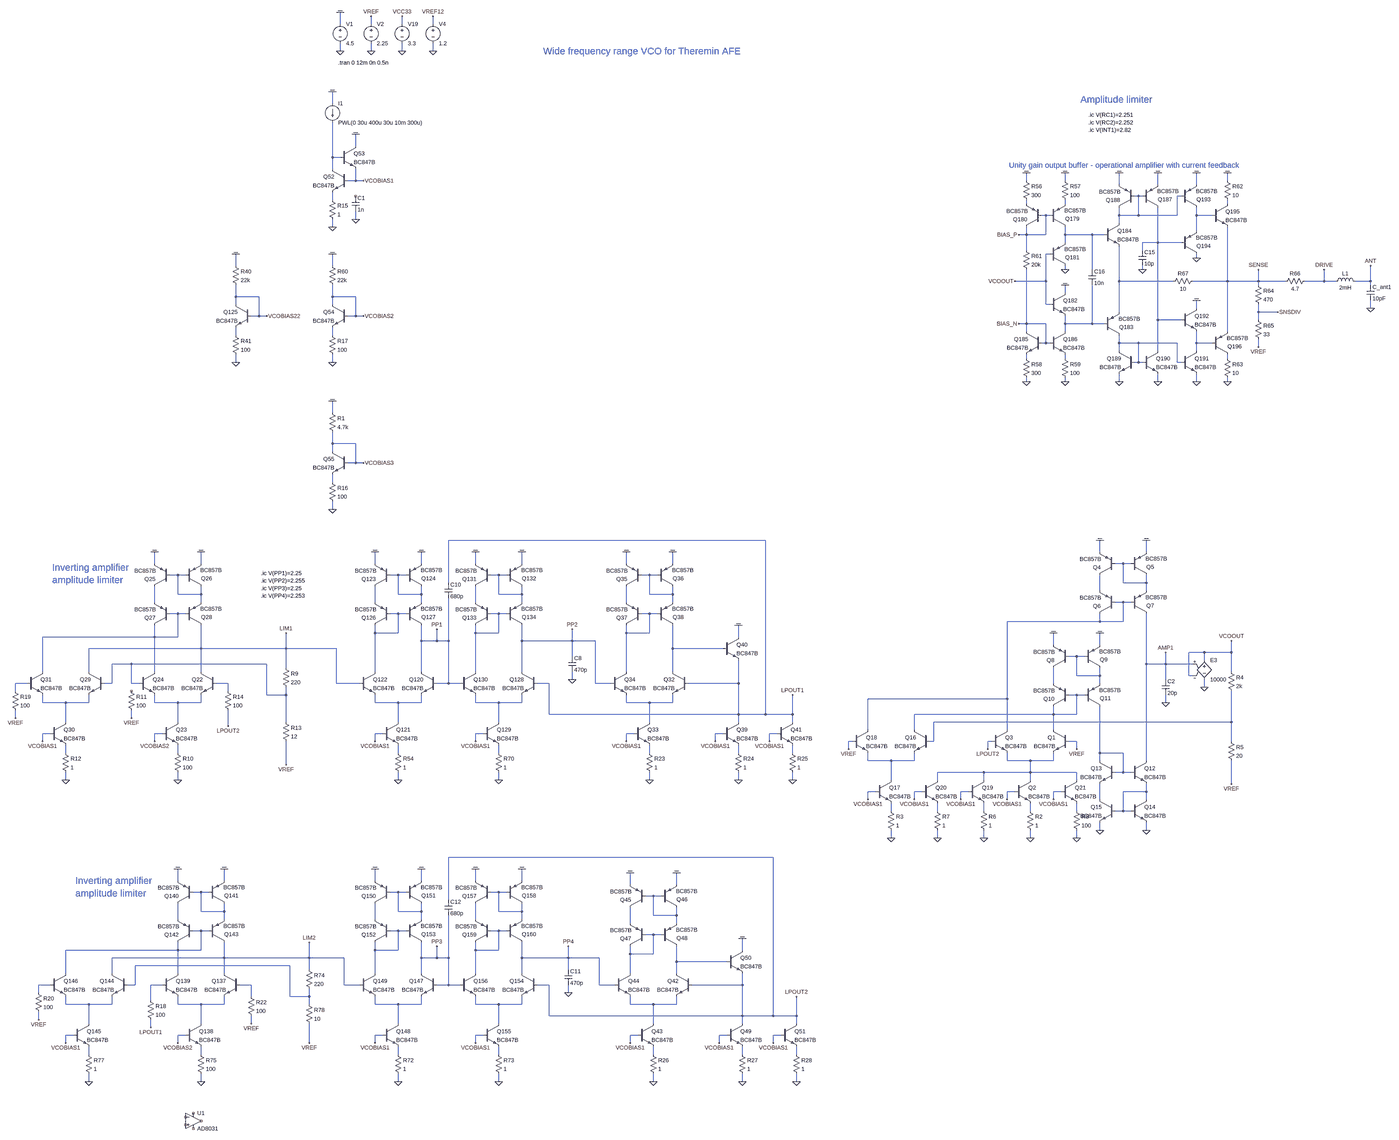
[diagram p0: schematic vco_sine_bjt_v03.asc, whole sheet]
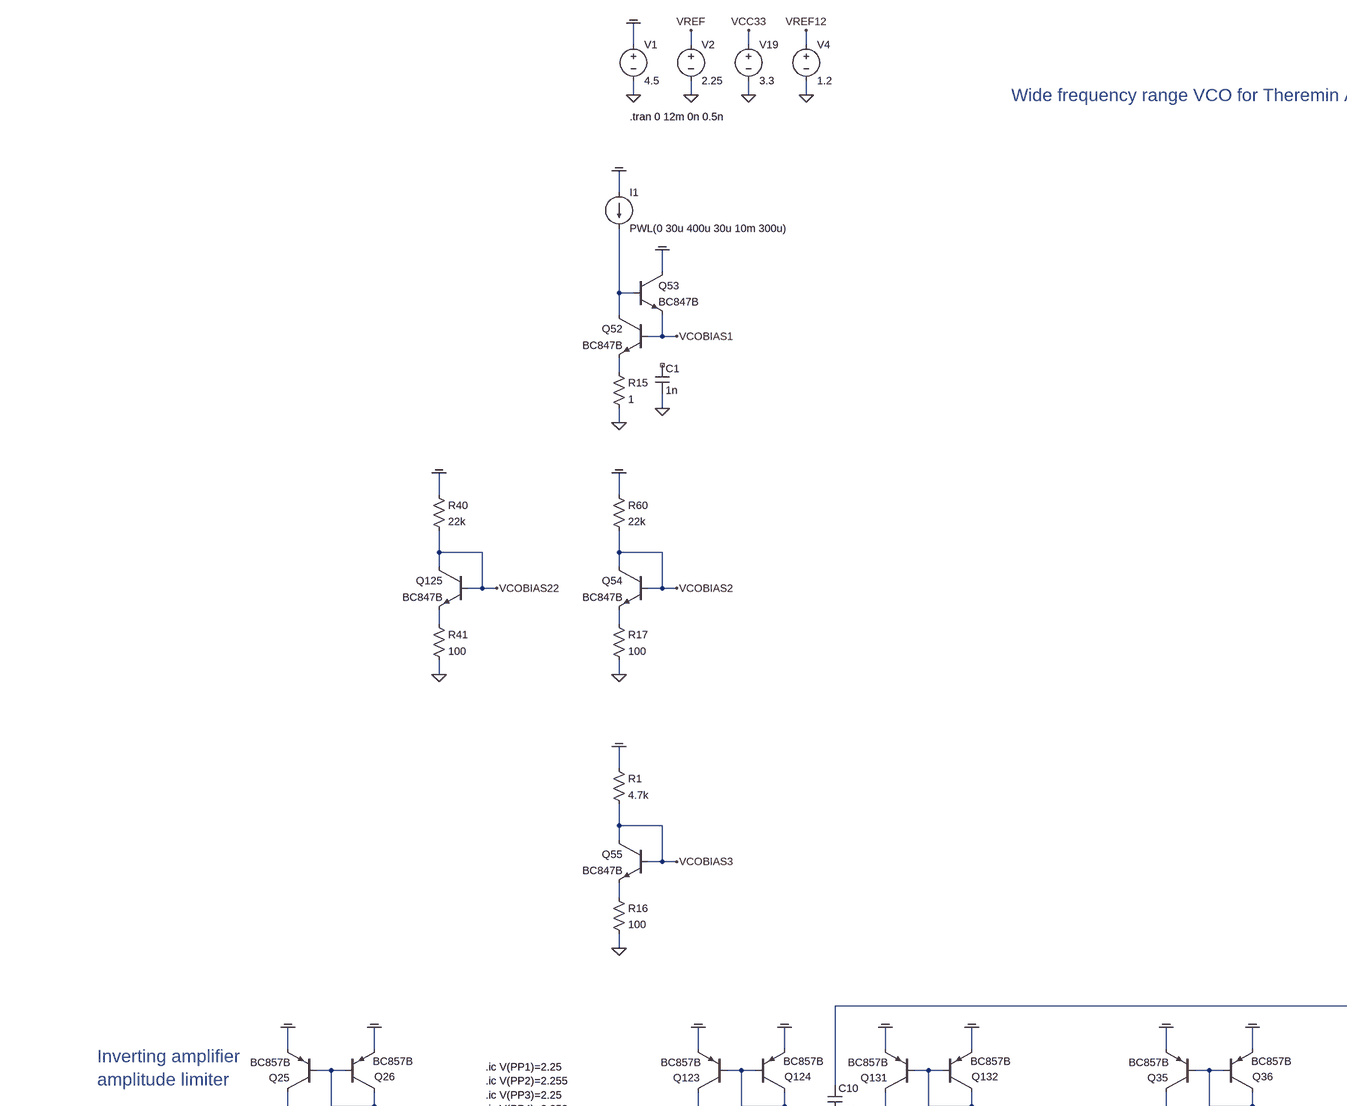
[diagram p1: schematic vco_sine_bjt_v03.asc, part, row 1 of 2, column 1 of 2]
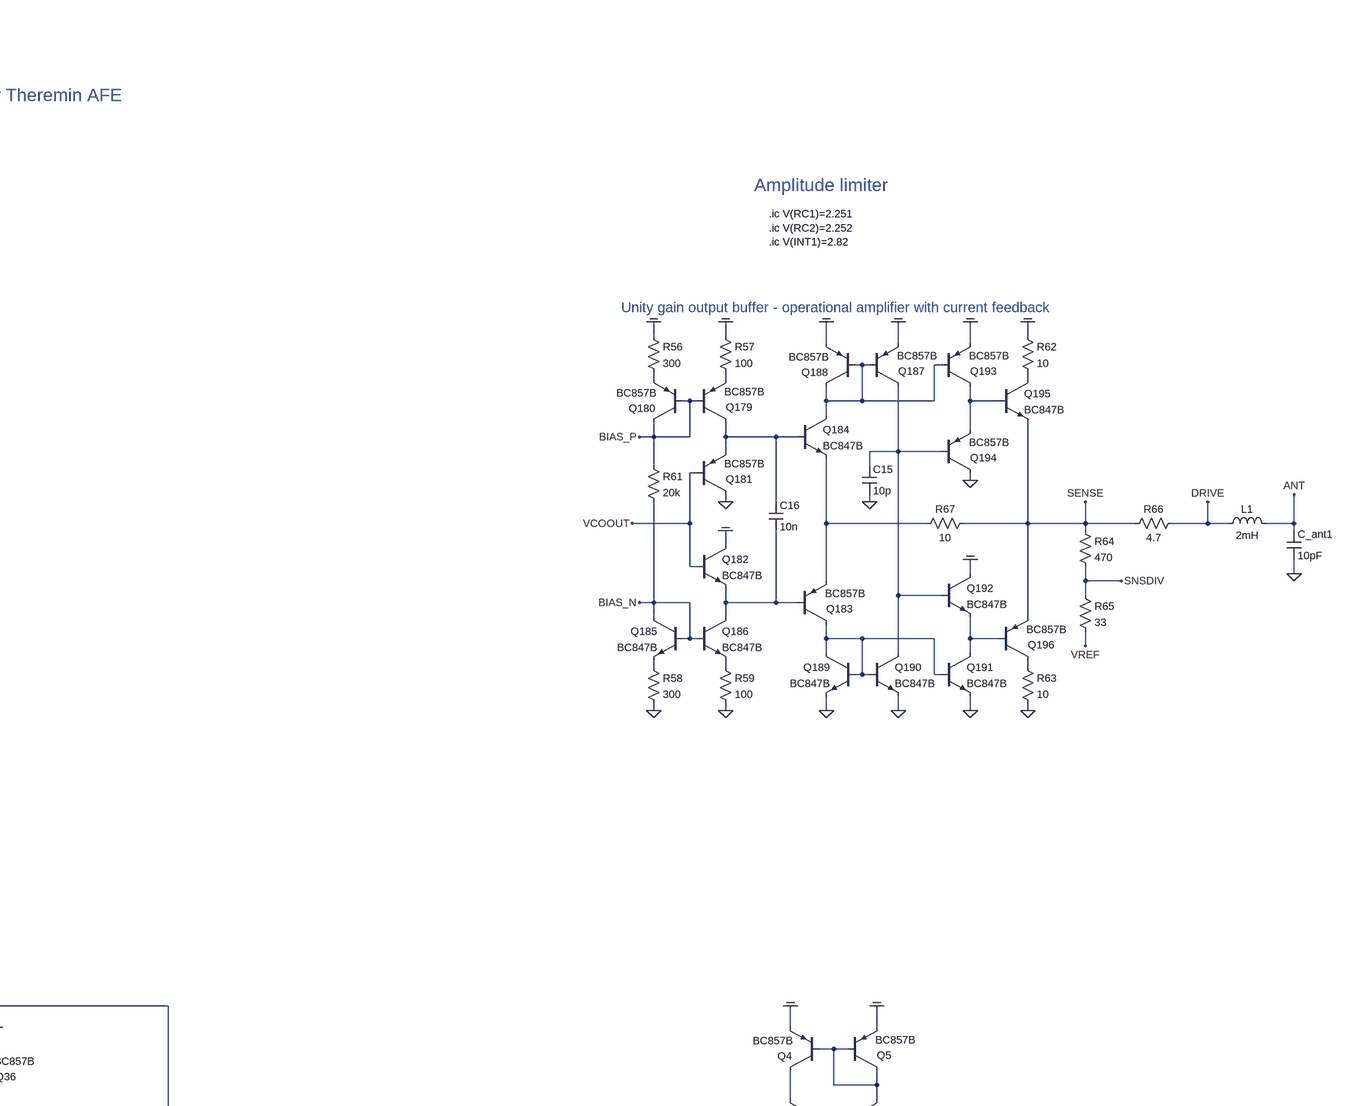
[diagram p2: schematic vco_sine_bjt_v03.asc, part, row 1 of 2, column 2 of 2]
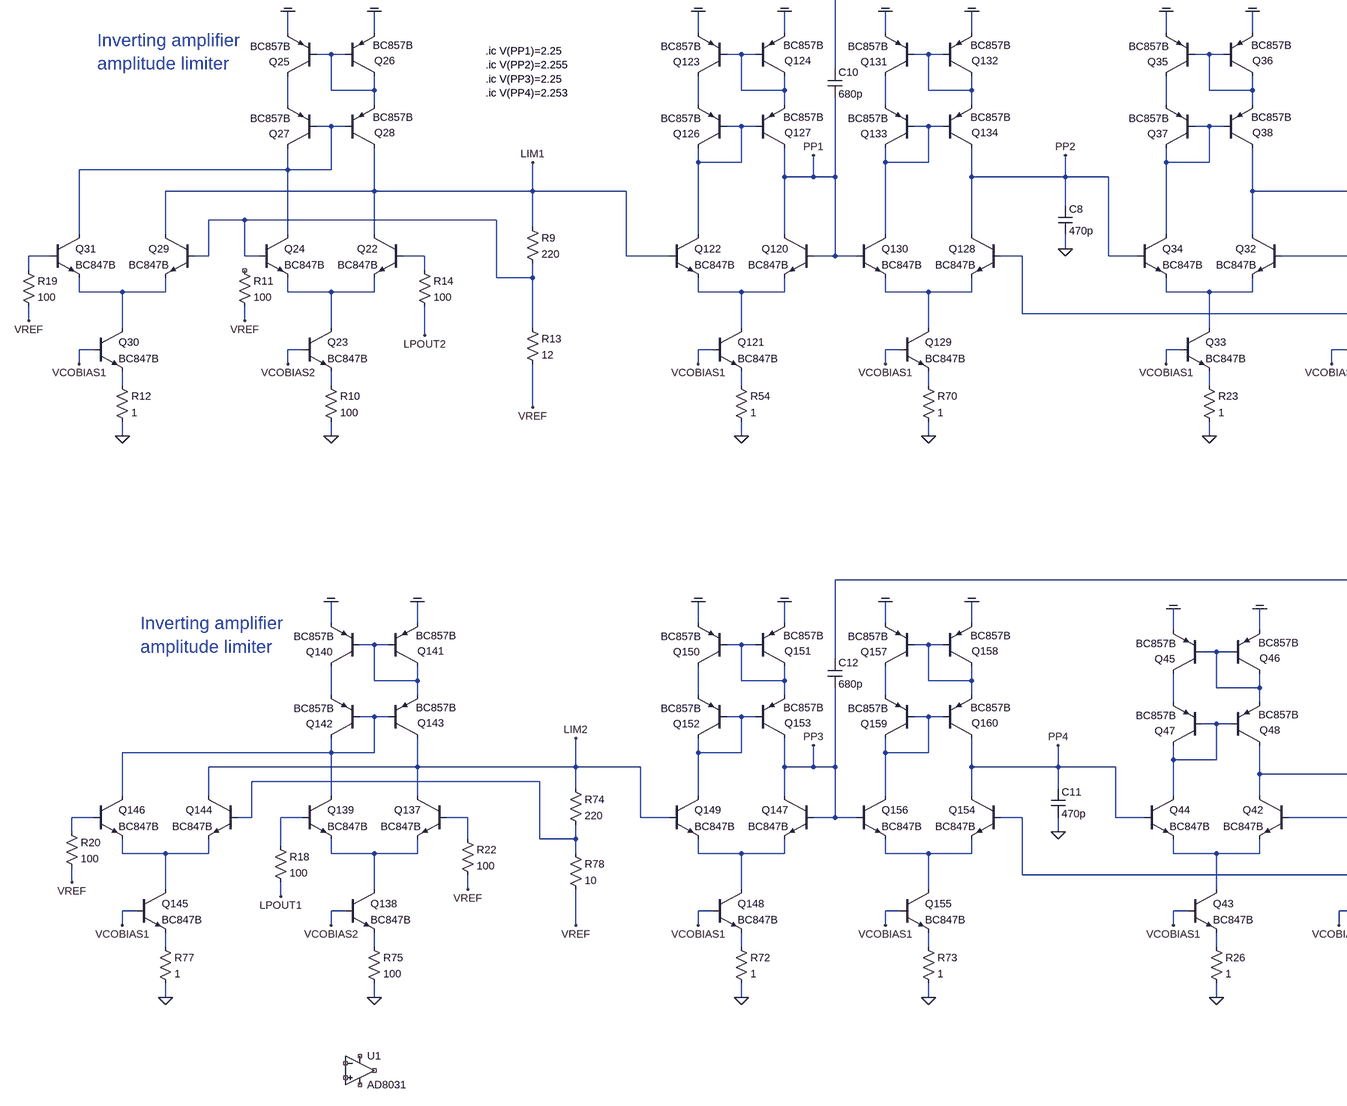
[diagram p3: schematic vco_sine_bjt_v03.asc, part, row 2 of 2, column 1 of 2]
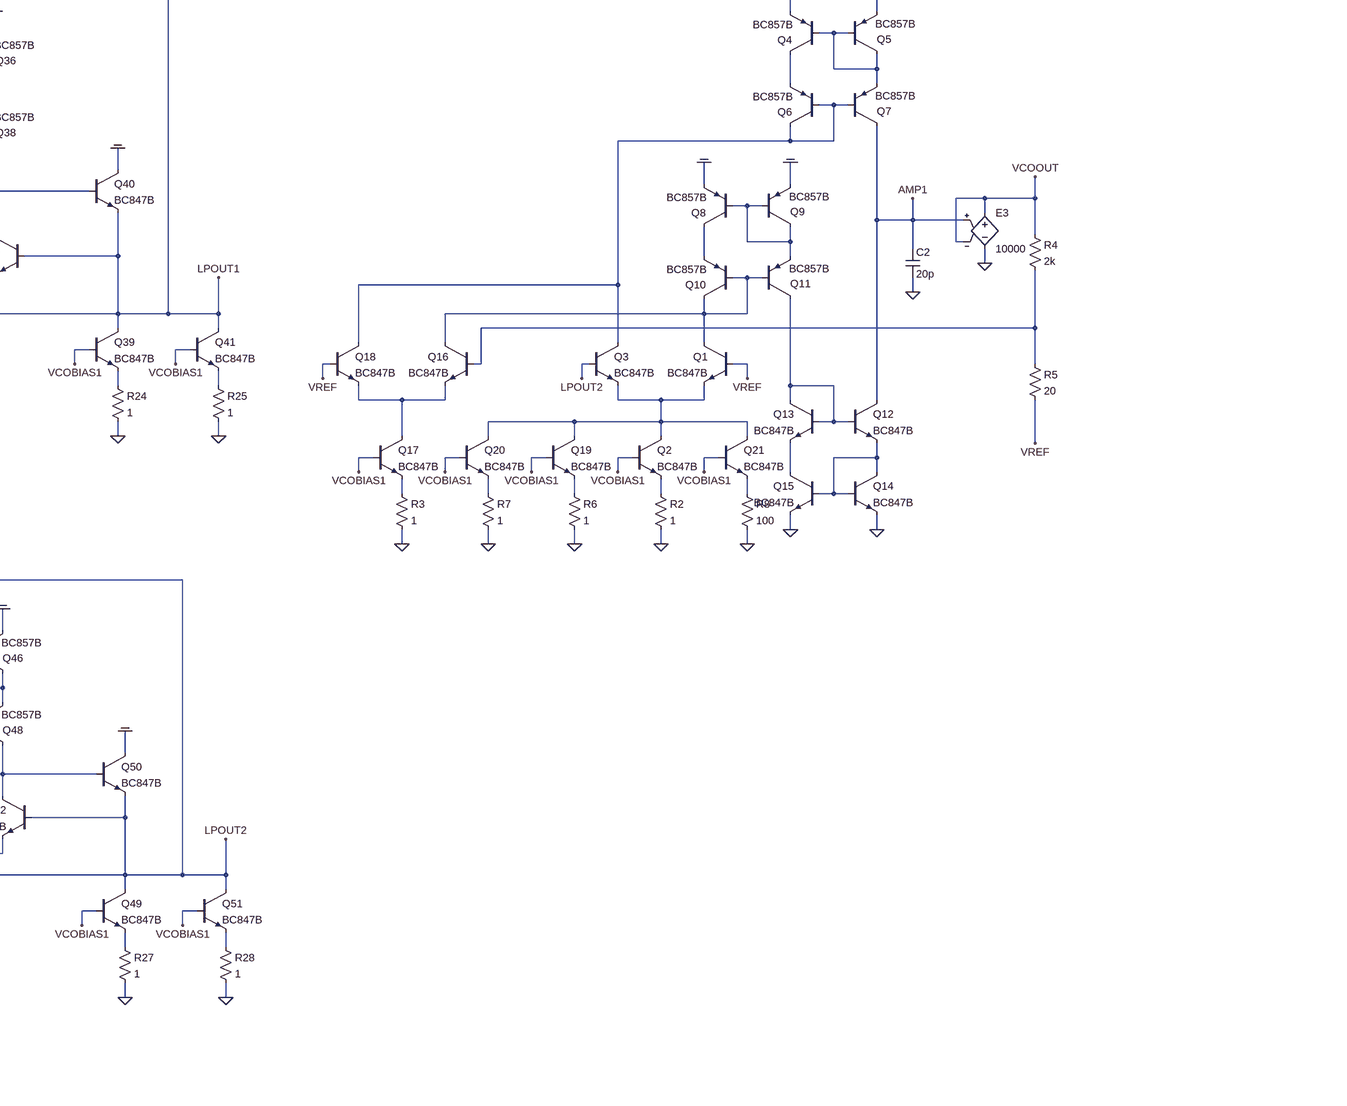
[diagram p4: schematic vco_sine_bjt_v03.asc, part, row 2 of 2, column 2 of 2]
vco_sine_bjt_v03.asc, the LTspice schematic file:
Version 4
SHEET 1 13504 19328
WIRE -432 13600 -432 13552
WIRE -304 13600 -304 13568
WIRE -176 13600 -176 13568
WIRE -48 13600 -48 13568
WIRE -432 13712 -432 13680
WIRE -304 13712 -304 13680
WIRE -176 13712 -176 13680
WIRE -48 13712 -48 13680
WIRE -464 14000 -464 13952
WIRE -368 14176 -368 14128
WIRE -464 14224 -464 14080
WIRE -432 14224 -464 14224
WIRE -464 14272 -464 14224
WIRE -368 14320 -368 14272
WIRE -368 14320 -400 14320
WIRE -336 14320 -368 14320
WIRE 2576 14320 2576 14288
WIRE 2736 14320 2736 14288
WIRE 3408 14320 3408 14288
WIRE 2960 14336 2960 14288
WIRE 3120 14336 3120 14288
WIRE 3280 14336 3280 14288
WIRE 3040 14384 3024 14384
WIRE 3056 14384 3040 14384
WIRE 3216 14384 3200 14384
WIRE -464 14400 -464 14368
WIRE 2576 14416 2576 14400
WIRE 2736 14416 2736 14400
WIRE 3408 14416 3408 14400
WIRE 2656 14464 2640 14464
WIRE 2672 14464 2656 14464
WIRE 2960 14464 2960 14432
WIRE 3040 14464 3040 14384
WIRE 3040 14464 2960 14464
WIRE 3200 14464 3200 14384
WIRE 3200 14464 3040 14464
WIRE 3280 14464 3280 14432
WIRE 3344 14464 3280 14464
WIRE -368 14480 -368 14448
WIRE 2960 14496 2960 14464
WIRE -464 14512 -464 14480
WIRE 3280 14528 3280 14464
WIRE 2576 14544 2576 14512
WIRE 2576 14544 2544 14544
WIRE 2656 14544 2656 14464
WIRE 2656 14544 2576 14544
WIRE 2736 14544 2736 14512
WIRE 2848 14544 2736 14544
WIRE 2896 14544 2848 14544
WIRE 2736 14576 2736 14544
WIRE 3120 14576 3120 14432
WIRE 3120 14576 3056 14576
WIRE 3216 14576 3120 14576
WIRE 2576 14608 2576 14544
WIRE 3056 14608 3056 14576
WIRE 2672 14624 2656 14624
WIRE 3280 14640 3280 14624
WIRE -864 14672 -864 14624
WIRE -464 14672 -464 14624
WIRE 2736 14688 2736 14672
WIRE 2848 14688 2848 14544
WIRE 3056 14688 3056 14672
WIRE 2656 14736 2656 14624
WIRE 2656 14736 2528 14736
WIRE 2960 14736 2960 14592
WIRE 3184 14736 2960 14736
WIRE 3408 14736 3408 14512
WIRE 3408 14736 3264 14736
WIRE 3536 14736 3536 14688
WIRE 3536 14736 3408 14736
WIRE 3648 14736 3536 14736
WIRE 3808 14736 3808 14688
WIRE 3808 14736 3728 14736
WIRE 3856 14736 3808 14736
WIRE 4000 14736 4000 14672
WIRE 4000 14736 3936 14736
WIRE 3536 14752 3536 14736
WIRE 4000 14752 4000 14736
WIRE 2736 14784 2736 14752
WIRE -864 14800 -864 14752
WIRE -768 14800 -864 14800
WIRE -464 14800 -464 14752
WIRE -368 14800 -464 14800
WIRE -864 14832 -864 14800
WIRE -464 14832 -464 14800
WIRE 2656 14832 2656 14736
WIRE 2672 14832 2656 14832
WIRE 3280 14848 3280 14816
WIRE 4000 14848 4000 14816
WIRE 2960 14864 2960 14736
WIRE 3536 14864 3536 14832
WIRE 3616 14864 3536 14864
WIRE -768 14880 -768 14800
WIRE -768 14880 -800 14880
WIRE -736 14880 -768 14880
WIRE -368 14880 -368 14800
WIRE -368 14880 -400 14880
WIRE -336 14880 -368 14880
WIRE 3120 14896 3120 14576
WIRE 3216 14896 3120 14896
WIRE 3536 14896 3536 14864
WIRE 2576 14912 2576 14688
WIRE 2576 14912 2544 14912
WIRE 2656 14912 2576 14912
WIRE 2736 14912 2736 14880
WIRE 2848 14912 2848 14752
WIRE 2848 14912 2736 14912
WIRE 2896 14912 2848 14912
WIRE 2576 14944 2576 14912
WIRE 2736 14944 2736 14912
WIRE 3408 14944 3408 14736
WIRE -864 14960 -864 14928
WIRE -464 14960 -464 14928
WIRE 2656 14992 2656 14912
WIRE 2656 14992 2640 14992
WIRE 2672 14992 2656 14992
WIRE 2960 14992 2960 14960
WIRE 3040 14992 2960 14992
WIRE 3200 14992 3040 14992
WIRE 3280 14992 3280 14944
WIRE 3344 14992 3280 14992
WIRE 3536 15008 3536 14976
WIRE 2960 15024 2960 14992
WIRE 3120 15024 3120 14896
WIRE 3280 15024 3280 14992
WIRE 2576 15056 2576 15040
WIRE 2736 15056 2736 15040
WIRE 3408 15056 3408 15040
WIRE -864 15072 -864 15040
WIRE -464 15072 -464 15040
WIRE 3040 15072 3040 14992
WIRE 3040 15072 3024 15072
WIRE 3056 15072 3040 15072
WIRE 3200 15072 3200 14992
WIRE 3216 15072 3200 15072
WIRE 2576 15152 2576 15136
WIRE 2736 15152 2736 15136
WIRE 2960 15152 2960 15120
WIRE 3120 15152 3120 15120
WIRE 3280 15152 3280 15120
WIRE 3408 15152 3408 15136
WIRE -464 15280 -464 15232
WIRE -464 15408 -464 15360
WIRE -368 15408 -464 15408
WIRE -464 15440 -464 15408
WIRE -368 15488 -368 15408
WIRE -368 15488 -400 15488
WIRE -336 15488 -368 15488
WIRE -464 15568 -464 15536
WIRE -464 15680 -464 15648
WIRE 1328 15920 16 15920
WIRE 2880 15968 2880 15920
WIRE 3072 15968 3072 15920
WIRE -1200 16016 -1200 15968
WIRE -1008 16016 -1008 15968
WIRE -288 16016 -288 15968
WIRE -96 16016 -96 15968
WIRE 128 16016 128 15968
WIRE 320 16016 320 15968
WIRE 752 16016 752 15968
WIRE 944 16016 944 15968
WIRE 2976 16016 2944 16016
WIRE 3008 16016 2976 16016
WIRE -1104 16064 -1136 16064
WIRE -1072 16064 -1104 16064
WIRE -192 16064 -224 16064
WIRE -160 16064 -192 16064
WIRE 224 16064 192 16064
WIRE 256 16064 224 16064
WIRE 848 16064 816 16064
WIRE 880 16064 848 16064
WIRE 16 16096 16 15920
WIRE 2976 16096 2976 16016
WIRE 3072 16096 3072 16064
WIRE 3072 16096 2976 16096
WIRE 2880 16128 2880 16064
WIRE 3072 16128 3072 16096
WIRE -1104 16144 -1104 16064
WIRE -1008 16144 -1008 16112
WIRE -1008 16144 -1104 16144
WIRE -192 16144 -192 16064
WIRE -96 16144 -96 16112
WIRE -96 16144 -192 16144
WIRE 224 16144 224 16064
WIRE 320 16144 320 16112
WIRE 320 16144 224 16144
WIRE 848 16144 848 16064
WIRE 944 16144 944 16112
WIRE 944 16144 848 16144
WIRE -1200 16176 -1200 16112
WIRE -1008 16176 -1008 16144
WIRE -288 16176 -288 16112
WIRE -96 16176 -96 16144
WIRE 128 16176 128 16112
WIRE 320 16176 320 16144
WIRE 752 16176 752 16112
WIRE 944 16176 944 16144
WIRE 2976 16176 2944 16176
WIRE 3008 16176 2976 16176
WIRE -1104 16224 -1136 16224
WIRE -1072 16224 -1104 16224
WIRE -192 16224 -224 16224
WIRE -160 16224 -192 16224
WIRE 224 16224 192 16224
WIRE 256 16224 224 16224
WIRE 848 16224 816 16224
WIRE 880 16224 848 16224
WIRE 2880 16256 2880 16224
WIRE 2880 16256 2496 16256
WIRE 2976 16256 2976 16176
WIRE 2976 16256 2880 16256
WIRE -288 16304 -288 16272
WIRE -192 16304 -192 16224
WIRE -192 16304 -288 16304
WIRE 128 16304 128 16272
WIRE 224 16304 224 16224
WIRE 224 16304 128 16304
WIRE 752 16304 752 16272
WIRE 848 16304 848 16224
WIRE 848 16304 752 16304
WIRE -1200 16320 -1200 16272
WIRE -1200 16320 -1664 16320
WIRE -1104 16320 -1104 16224
WIRE -1104 16320 -1200 16320
WIRE 1216 16320 1216 16272
WIRE -96 16336 -96 16272
WIRE -32 16336 -32 16288
WIRE -32 16336 -96 16336
WIRE 16 16336 16 16160
WIRE 16 16336 -32 16336
WIRE 320 16336 320 16272
WIRE 528 16336 528 16288
WIRE 528 16336 320 16336
WIRE 624 16336 528 16336
WIRE 2688 16352 2688 16304
WIRE 2880 16352 2880 16304
WIRE -1008 16368 -1008 16272
WIRE -1008 16368 -1472 16368
WIRE -656 16368 -656 16304
WIRE -656 16368 -1008 16368
WIRE -448 16368 -656 16368
WIRE 944 16368 944 16272
WIRE 1152 16368 944 16368
WIRE 3312 16384 3248 16384
WIRE 3424 16384 3424 16336
WIRE 3424 16384 3312 16384
WIRE 528 16400 528 16336
WIRE 2784 16400 2752 16400
WIRE 2816 16400 2784 16400
WIRE 3312 16416 3312 16384
WIRE -1296 16432 -1376 16432
WIRE -736 16432 -1296 16432
WIRE 3072 16432 3072 16224
WIRE 3152 16432 3152 16384
WIRE 3152 16432 3072 16432
WIRE 3264 16432 3152 16432
WIRE -656 16448 -656 16368
WIRE -1664 16464 -1664 16320
WIRE -1472 16464 -1472 16368
WIRE -1200 16464 -1200 16320
WIRE -1008 16464 -1008 16368
WIRE -288 16464 -288 16304
WIRE -96 16464 -96 16336
WIRE 128 16464 128 16304
WIRE 320 16464 320 16336
WIRE 752 16464 752 16304
WIRE 944 16464 944 16368
WIRE 3424 16464 3424 16384
WIRE 2784 16480 2784 16400
WIRE 2880 16480 2880 16448
WIRE 2880 16480 2784 16480
WIRE 3248 16480 3248 16384
WIRE 3264 16480 3248 16480
WIRE 528 16496 528 16464
WIRE 3152 16496 3152 16432
WIRE -1728 16512 -1776 16512
WIRE -1376 16512 -1376 16432
WIRE -1376 16512 -1408 16512
WIRE -1296 16512 -1296 16432
WIRE -1264 16512 -1296 16512
WIRE -896 16512 -944 16512
WIRE -448 16512 -448 16368
WIRE -352 16512 -448 16512
WIRE 16 16512 16 16336
WIRE 16 16512 -32 16512
WIRE 64 16512 16 16512
WIRE 432 16512 384 16512
WIRE 624 16512 624 16336
WIRE 688 16512 624 16512
WIRE 1216 16512 1216 16416
WIRE 1216 16512 1008 16512
WIRE 2688 16512 2688 16448
WIRE 2880 16512 2880 16480
WIRE 3312 16528 3312 16496
WIRE -1776 16544 -1776 16512
WIRE -896 16544 -896 16512
WIRE -736 16560 -736 16432
WIRE -656 16560 -656 16528
WIRE -656 16560 -736 16560
WIRE 2784 16560 2752 16560
WIRE 2816 16560 2784 16560
WIRE 2496 16576 2496 16256
WIRE 2496 16576 1920 16576
WIRE -1664 16592 -1664 16560
WIRE -1568 16592 -1664 16592
WIRE -1472 16592 -1472 16560
WIRE -1472 16592 -1568 16592
WIRE -1200 16592 -1200 16560
WIRE -1104 16592 -1200 16592
WIRE -1008 16592 -1008 16560
WIRE -1008 16592 -1104 16592
WIRE -288 16592 -288 16560
WIRE -192 16592 -288 16592
WIRE -96 16592 -96 16560
WIRE -96 16592 -192 16592
WIRE 128 16592 128 16560
WIRE 224 16592 128 16592
WIRE 320 16592 320 16560
WIRE 320 16592 224 16592
WIRE 752 16592 752 16560
WIRE 848 16592 752 16592
WIRE 944 16592 944 16560
WIRE 944 16592 848 16592
WIRE 3152 16592 3152 16560
WIRE 432 16640 432 16512
WIRE 1216 16640 1216 16512
WIRE 1216 16640 432 16640
WIRE 1328 16640 1328 15920
WIRE 1328 16640 1216 16640
WIRE 1440 16640 1440 16560
WIRE 1440 16640 1328 16640
WIRE 2688 16640 2688 16608
WIRE 2688 16640 2112 16640
WIRE 2784 16640 2784 16560
WIRE 2784 16640 2688 16640
WIRE -1776 16656 -1776 16624
WIRE -1296 16656 -1296 16624
WIRE -1568 16672 -1568 16592
WIRE -1104 16672 -1104 16592
WIRE -656 16672 -656 16560
WIRE -192 16672 -192 16592
WIRE 224 16672 224 16592
WIRE 848 16672 848 16592
WIRE 1216 16672 1216 16640
WIRE 1440 16672 1440 16640
WIRE 3424 16672 3424 16544
WIRE 3424 16672 2192 16672
WIRE -896 16688 -896 16624
WIRE 1920 16704 1920 16576
WIRE 2112 16704 2112 16640
WIRE 2496 16704 2496 16576
WIRE 2688 16704 2688 16640
WIRE -1632 16720 -1664 16720
WIRE -1168 16720 -1200 16720
WIRE -256 16720 -288 16720
WIRE 160 16720 128 16720
WIRE 784 16720 752 16720
WIRE 1152 16720 1120 16720
WIRE 1376 16720 1344 16720
WIRE -1664 16752 -1664 16720
WIRE -1200 16752 -1200 16720
WIRE -288 16752 -288 16720
WIRE 128 16752 128 16720
WIRE 752 16752 752 16720
WIRE 1120 16752 1120 16720
WIRE 1344 16752 1344 16720
WIRE 1856 16752 1840 16752
WIRE 2192 16752 2192 16672
WIRE 2192 16752 2176 16752
WIRE 2432 16752 2416 16752
WIRE 2784 16752 2752 16752
WIRE 3424 16752 3424 16672
WIRE 1840 16784 1840 16752
WIRE 2416 16784 2416 16752
WIRE 2784 16784 2784 16752
WIRE -1568 16800 -1568 16768
WIRE -1104 16800 -1104 16768
WIRE -192 16800 -192 16768
WIRE 224 16800 224 16768
WIRE 848 16800 848 16768
WIRE 1216 16800 1216 16768
WIRE 1440 16800 1440 16768
WIRE 2880 16800 2880 16608
WIRE 2976 16800 2880 16800
WIRE 1920 16832 1920 16800
WIRE 2016 16832 1920 16832
WIRE 2112 16832 2112 16800
WIRE 2112 16832 2016 16832
WIRE 2496 16832 2496 16800
WIRE 2592 16832 2496 16832
WIRE 2688 16832 2688 16800
WIRE 2688 16832 2592 16832
WIRE 2880 16832 2880 16800
WIRE 3072 16832 3072 16432
WIRE -656 16848 -656 16752
WIRE 2400 16880 2208 16880
WIRE 2592 16880 2592 16832
WIRE 2592 16880 2400 16880
WIRE 2784 16880 2592 16880
WIRE 2976 16880 2976 16800
WIRE 2976 16880 2944 16880
WIRE 3008 16880 2976 16880
WIRE -1568 16912 -1568 16880
WIRE -1104 16912 -1104 16880
WIRE -192 16912 -192 16880
WIRE 224 16912 224 16880
WIRE 848 16912 848 16880
WIRE 1216 16912 1216 16880
WIRE 1440 16912 1440 16880
WIRE 2016 16912 2016 16832
WIRE 2208 16912 2208 16880
WIRE 2400 16912 2400 16880
WIRE 2592 16912 2592 16880
WIRE 2784 16912 2784 16880
WIRE 3424 16928 3424 16832
WIRE 1952 16960 1920 16960
WIRE 2144 16960 2112 16960
WIRE 2336 16960 2304 16960
WIRE 2528 16960 2496 16960
WIRE 2720 16960 2688 16960
WIRE 3072 16960 3072 16928
WIRE 3072 16960 2976 16960
WIRE 1920 16992 1920 16960
WIRE 2112 16992 2112 16960
WIRE 2304 16992 2304 16960
WIRE 2496 16992 2496 16960
WIRE 2688 16992 2688 16960
WIRE 2880 16992 2880 16928
WIRE 3072 16992 3072 16960
WIRE 2016 17040 2016 17008
WIRE 2208 17040 2208 17008
WIRE 2400 17040 2400 17008
WIRE 2592 17040 2592 17008
WIRE 2784 17040 2784 17008
WIRE 2976 17040 2976 16960
WIRE 2976 17040 2944 17040
WIRE 3008 17040 2976 17040
WIRE 2880 17120 2880 17088
WIRE 3072 17120 3072 17088
WIRE 2016 17152 2016 17120
WIRE 2208 17152 2208 17120
WIRE 2400 17152 2400 17120
WIRE 2592 17152 2592 17120
WIRE 2784 17152 2784 17120
WIRE 1360 17232 16 17232
WIRE -1104 17328 -1104 17280
WIRE -912 17328 -912 17280
WIRE -288 17328 -288 17280
WIRE -96 17328 -96 17280
WIRE 128 17328 128 17280
WIRE 320 17328 320 17280
WIRE 768 17344 768 17296
WIRE 960 17344 960 17296
WIRE -1008 17376 -1040 17376
WIRE -976 17376 -1008 17376
WIRE -192 17376 -224 17376
WIRE -160 17376 -192 17376
WIRE 224 17376 192 17376
WIRE 256 17376 224 17376
WIRE 864 17392 832 17392
WIRE 896 17392 864 17392
WIRE 16 17408 16 17232
WIRE -1008 17456 -1008 17376
WIRE -912 17456 -912 17424
WIRE -912 17456 -1008 17456
WIRE -192 17456 -192 17376
WIRE -96 17456 -96 17424
WIRE -96 17456 -192 17456
WIRE 224 17456 224 17376
WIRE 320 17456 320 17424
WIRE 320 17456 224 17456
WIRE 864 17472 864 17392
WIRE 960 17472 960 17440
WIRE 960 17472 864 17472
WIRE -1104 17488 -1104 17424
WIRE -912 17488 -912 17456
WIRE -288 17488 -288 17424
WIRE -96 17488 -96 17456
WIRE 128 17488 128 17424
WIRE 320 17488 320 17456
WIRE 768 17504 768 17440
WIRE 960 17504 960 17472
WIRE -1008 17536 -1040 17536
WIRE -976 17536 -1008 17536
WIRE -192 17536 -224 17536
WIRE -160 17536 -192 17536
WIRE 224 17536 192 17536
WIRE 256 17536 224 17536
WIRE 864 17552 832 17552
WIRE 896 17552 864 17552
WIRE -1104 17616 -1104 17584
WIRE -1104 17616 -1568 17616
WIRE -1008 17616 -1008 17536
WIRE -1008 17616 -1104 17616
WIRE -288 17616 -288 17584
WIRE -192 17616 -192 17536
WIRE -192 17616 -288 17616
WIRE 128 17616 128 17584
WIRE 224 17616 224 17536
WIRE 224 17616 128 17616
WIRE 1232 17616 1232 17568
WIRE 768 17632 768 17600
WIRE 864 17632 864 17552
WIRE 864 17632 768 17632
WIRE -912 17648 -912 17584
WIRE -912 17648 -1376 17648
WIRE -560 17648 -560 17584
WIRE -560 17648 -912 17648
WIRE -416 17648 -560 17648
WIRE -96 17648 -96 17584
WIRE -32 17648 -32 17600
WIRE -32 17648 -96 17648
WIRE 16 17648 16 17472
WIRE 16 17648 -32 17648
WIRE 320 17648 320 17584
WIRE 512 17648 512 17600
WIRE 512 17648 320 17648
WIRE 640 17648 512 17648
WIRE 960 17664 960 17600
WIRE 1168 17664 960 17664
WIRE -640 17680 -1280 17680
WIRE -560 17696 -560 17648
WIRE 512 17696 512 17648
WIRE -1568 17712 -1568 17616
WIRE -1376 17712 -1376 17648
WIRE -1104 17712 -1104 17616
WIRE -912 17712 -912 17648
WIRE -288 17712 -288 17616
WIRE -96 17712 -96 17648
WIRE 128 17712 128 17616
WIRE 320 17712 320 17648
WIRE 768 17712 768 17632
WIRE 960 17712 960 17664
WIRE -1632 17760 -1680 17760
WIRE -1280 17760 -1280 17680
WIRE -1280 17760 -1312 17760
WIRE -1168 17760 -1216 17760
WIRE -800 17760 -848 17760
WIRE -416 17760 -416 17648
WIRE -352 17760 -416 17760
WIRE 16 17760 16 17648
WIRE 16 17760 -32 17760
WIRE 64 17760 16 17760
WIRE 432 17760 384 17760
WIRE 640 17760 640 17648
WIRE 704 17760 640 17760
WIRE 1232 17760 1232 17712
WIRE 1232 17760 1024 17760
WIRE -1680 17792 -1680 17760
WIRE 512 17792 512 17760
WIRE -800 17808 -800 17760
WIRE -640 17808 -640 17680
WIRE -560 17808 -560 17776
WIRE -560 17808 -640 17808
WIRE -1216 17824 -1216 17760
WIRE -1568 17840 -1568 17808
WIRE -1472 17840 -1568 17840
WIRE -1376 17840 -1376 17808
WIRE -1376 17840 -1472 17840
WIRE -1104 17840 -1104 17808
WIRE -1008 17840 -1104 17840
WIRE -912 17840 -912 17808
WIRE -912 17840 -1008 17840
WIRE -560 17840 -560 17808
WIRE -288 17840 -288 17808
WIRE -192 17840 -288 17840
WIRE -96 17840 -96 17808
WIRE -96 17840 -192 17840
WIRE 128 17840 128 17808
WIRE 224 17840 128 17840
WIRE 320 17840 320 17808
WIRE 320 17840 224 17840
WIRE 768 17840 768 17808
WIRE 864 17840 768 17840
WIRE 960 17840 960 17808
WIRE 960 17840 864 17840
WIRE 432 17888 432 17760
WIRE 1232 17888 1232 17760
WIRE 1232 17888 432 17888
WIRE 1360 17888 1360 17232
WIRE 1360 17888 1232 17888
WIRE 1456 17888 1456 17808
WIRE 1456 17888 1360 17888
WIRE -1680 17904 -1680 17872
WIRE -1472 17920 -1472 17840
WIRE -1008 17920 -1008 17840
WIRE -800 17920 -800 17888
WIRE -192 17920 -192 17840
WIRE 224 17920 224 17840
WIRE 864 17920 864 17840
WIRE 1232 17920 1232 17888
WIRE 1456 17920 1456 17888
WIRE -1216 17936 -1216 17904
WIRE -1536 17968 -1568 17968
WIRE -1072 17968 -1104 17968
WIRE -256 17968 -288 17968
WIRE 160 17968 128 17968
WIRE 800 17968 768 17968
WIRE 1168 17968 1136 17968
WIRE 1392 17968 1360 17968
WIRE -1568 18000 -1568 17968
WIRE -1104 18000 -1104 17968
WIRE -560 18000 -560 17920
WIRE -288 18000 -288 17968
WIRE 128 18000 128 17968
WIRE 768 18000 768 17968
WIRE 1136 18000 1136 17968
WIRE 1360 18000 1360 17968
WIRE -1472 18048 -1472 18016
WIRE -1008 18048 -1008 18016
WIRE -192 18048 -192 18016
WIRE 224 18048 224 18016
WIRE 864 18048 864 18016
WIRE 1232 18048 1232 18016
WIRE 1456 18048 1456 18016
WIRE -1472 18160 -1472 18128
WIRE -1008 18160 -1008 18128
WIRE -192 18160 -192 18128
WIRE 224 18160 224 18128
WIRE 864 18160 864 18128
WIRE 1232 18160 1232 18128
WIRE 1456 18160 1456 18128
FLAG -432 13712 0
FLAG -432 13552 COM
FLAG -304 13712 0
FLAG -304 13568 VREF
FLAG -176 13712 0
FLAG -176 13568 VCC33
FLAG -48 13712 0
FLAG -48 13568 VREF12
FLAG -336 14320 VCOBIAS1
FLAG -464 14624 COM
FLAG -464 15232 COM
FLAG -464 13952 COM
FLAG -336 14880 VCOBIAS2
FLAG -336 15488 VCOBIAS3
FLAG -368 14128 COM
FLAG -464 14512 0
FLAG -464 15680 0
FLAG -464 15072 0
FLAG -368 14480 0
FLAG -864 14624 COM
FLAG -736 14880 VCOBIAS22
FLAG -864 15072 0
FLAG 2576 15152 0
FLAG 2736 15152 0
FLAG 2736 14288 COM
FLAG 2576 14288 COM
FLAG 2736 14688 0
FLAG 2736 14752 COM
FLAG 2544 14912 BIAS_N
FLAG 2544 14544 BIAS_P
FLAG 3120 14288 COM
FLAG 2960 14288 COM
FLAG 2960 15152 0
FLAG 3120 15152 0
FLAG 3056 14688 0
FLAG 3280 15152 0
FLAG 3280 14816 COM
FLAG 3280 14288 COM
FLAG 3280 14640 0
FLAG 3408 14288 COM
FLAG 3408 15152 0
FLAG 3536 15008 VREF
FLAG 2528 14736 VCOOUT
FLAG 4000 14848 0
FLAG 4000 14672 ANT
FLAG 3808 14688 DRIVE
FLAG 3536 14688 SENSE
FLAG 3616 14864 SNSDIV
FLAG -288 16752 VCOBIAS1
FLAG -192 16912 0
FLAG -288 15968 COM
FLAG -96 15968 COM
FLAG 128 16752 VCOBIAS1
FLAG 224 16912 0
FLAG 128 15968 COM
FLAG 320 15968 COM
FLAG 528 16496 0
FLAG -1104 18000 VCOBIAS2
FLAG -560 18000 VREF
FLAG -560 17584 LIM2
FLAG -1008 18160 0
FLAG -1104 17280 COM
FLAG -912 17280 COM
FLAG -1568 18000 VCOBIAS1
FLAG -1472 18160 0
FLAG -288 18000 VCOBIAS1
FLAG -192 18160 0
FLAG -288 17280 COM
FLAG -96 17280 COM
FLAG 128 18000 VCOBIAS1
FLAG 224 18160 0
FLAG 128 17280 COM
FLAG 320 17280 COM
FLAG 512 17792 0
FLAG -32 16288 PP1
FLAG 528 16288 PP2
FLAG -32 17600 PP3
FLAG 512 17600 PP4
FLAG 1440 16560 LPOUT1
FLAG 2496 16992 VCOBIAS1
FLAG 2592 17152 0
FLAG 2880 15920 COM
FLAG 3072 15920 COM
FLAG 2688 16304 COM
FLAG 2880 16304 COM
FLAG 2880 17120 0
FLAG 3072 17120 0
FLAG 3152 16592 0
FLAG 3152 16384 AMP1
FLAG 3312 16528 0
FLAG 1920 16992 VCOBIAS1
FLAG 2016 17152 0
FLAG 2784 16784 VREF
FLAG 2416 16784 LPOUT2
FLAG 1840 16784 VREF
FLAG 3424 16928 VREF
FLAG 2304 16992 VCOBIAS1
FLAG 2400 17152 0
FLAG 2112 16992 VCOBIAS1
FLAG 2208 17152 0
FLAG 3424 16336 VCOOUT
FLAG 2688 16992 VCOBIAS1
FLAG 2784 17152 0
FLAG -1200 16752 VCOBIAS2
FLAG -656 16848 VREF
FLAG -656 16304 LIM1
FLAG -1104 16912 0
FLAG -1296 16656 VREF
FLAG -1200 15968 COM
FLAG -1008 15968 COM
FLAG -1664 16752 VCOBIAS1
FLAG -1568 16912 0
FLAG -896 16688 LPOUT2
FLAG -1216 17936 LPOUT1
FLAG -1776 16656 VREF
FLAG -1680 17904 VREF
FLAG -800 17920 VREF
FLAG 752 16752 VCOBIAS1
FLAG 848 16912 0
FLAG 752 15968 COM
FLAG 944 15968 COM
FLAG 1120 16752 VCOBIAS1
FLAG 1216 16912 0
FLAG 1216 16272 COM
FLAG 1344 16752 VCOBIAS1
FLAG 1440 16912 0
FLAG 1456 17808 LPOUT2
FLAG 768 18000 VCOBIAS1
FLAG 864 18160 0
FLAG 768 17296 COM
FLAG 960 17296 COM
FLAG 1136 18000 VCOBIAS1
FLAG 1232 18160 0
FLAG 1232 17568 COM
FLAG 1360 18000 VCOBIAS1
FLAG 1456 18160 0
SYMBOL voltage -432 13584 R0
SYMATTR InstName V1
SYMATTR Value 4.5
SYMBOL Voltage -304 13584 R0
SYMATTR InstName V2
SYMATTR Value 2.25
SYMBOL Voltage -176 13584 R0
SYMATTR InstName V19
SYMATTR Value 3.3
SYMBOL Voltage -48 13584 R0
SYMATTR InstName V4
SYMATTR Value 1.2
SYMBOL npn -400 14272 M0
SYMATTR InstName Q52
SYMATTR Value BC847B
SYMBOL Res -480 14656 R0
SYMATTR InstName R60
SYMATTR Value 22k
SYMBOL Res -480 15264 R0
SYMATTR InstName R1
SYMATTR Value 4.7k
SYMBOL current -464 14000 R0
SYMATTR InstName I1
SYMATTR Value PWL(0 30u 400u 30u 10m 300u)
SYMBOL npn -400 14832 M0
SYMATTR InstName Q54
SYMATTR Value BC847B
SYMBOL npn -400 15440 M0
SYMATTR InstName Q55
SYMATTR Value BC847B
SYMBOL npn -432 14176 R0
SYMATTR InstName Q53
SYMATTR Value BC847B
SYMBOL Res -480 14384 R0
SYMATTR InstName R15
SYMATTR Value 1
SYMBOL Res -480 15552 R0
SYMATTR InstName R16
SYMATTR Value 100
SYMBOL Res -480 14944 R0
SYMATTR InstName R17
SYMATTR Value 100
SYMBOL Cap -384 14384 R0
SYMATTR InstName C1
SYMATTR Value 1n
SYMBOL Res -880 14656 R0
SYMATTR InstName R40
SYMATTR Value 22k
SYMBOL npn -800 14832 M0
SYMATTR InstName Q125
SYMATTR Value BC847B
SYMBOL Res -880 14944 R0
SYMATTR InstName R41
SYMATTR Value 100
SYMBOL pnp 2672 14512 M180
WINDOW 0 64 34 Left 2
WINDOW 3 61 68 Left 2
SYMATTR InstName Q179
SYMATTR Value BC857B
SYMBOL pnp 2640 14512 R180
WINDOW 0 60 32 Left 2
WINDOW 3 58 66 Left 2
SYMATTR InstName Q180
SYMATTR Value BC857B
SYMBOL pnp 2672 14672 M180
WINDOW 0 64 34 Left 2
WINDOW 3 61 68 Left 2
SYMATTR InstName Q181
SYMATTR Value BC857B
SYMBOL npn 2672 14784 R0
SYMATTR InstName Q182
SYMATTR Value BC847B
SYMBOL pnp 2896 14960 M180
WINDOW 0 64 34 Left 2
WINDOW 3 61 68 Left 2
SYMATTR InstName Q183
SYMATTR Value BC857B
SYMBOL npn 2896 14496 R0
SYMATTR InstName Q184
SYMATTR Value BC847B
SYMBOL Res 2560 14304 R0
SYMATTR InstName R56
SYMATTR Value 300
SYMBOL Res 2720 14304 R0
SYMATTR InstName R57
SYMATTR Value 100
SYMBOL Res 2560 15040 R0
SYMATTR InstName R58
SYMATTR Value 300
SYMBOL Res 2720 15040 R0
SYMATTR InstName R59
SYMATTR Value 100
SYMBOL npn 2640 14944 M0
SYMATTR InstName Q185
SYMATTR Value BC847B
SYMBOL npn 2672 14944 R0
SYMATTR InstName Q186
SYMATTR Value BC847B
SYMBOL Res 2560 14592 R0
SYMATTR InstName R61
SYMATTR Value 20k
SYMBOL pnp 3056 14432 M180
WINDOW 0 64 34 Left 2
WINDOW 3 61 68 Left 2
SYMATTR InstName Q187
SYMATTR Value BC857B
SYMBOL pnp 3024 14432 R180
WINDOW 0 60 32 Left 2
WINDOW 3 58 66 Left 2
SYMATTR InstName Q188
SYMATTR Value BC857B
SYMBOL npn 3024 15024 M0
SYMATTR InstName Q189
SYMATTR Value BC847B
SYMBOL npn 3056 15024 R0
SYMATTR InstName Q190
SYMATTR Value BC847B
SYMBOL Cap 3040 14608 R0
SYMATTR InstName C15
SYMATTR Value 10p
SYMBOL npn 3216 15024 R0
SYMATTR InstName Q191
SYMATTR Value BC847B
SYMBOL npn 3216 14848 R0
SYMATTR InstName Q192
SYMATTR Value BC847B
SYMBOL pnp 3216 14432 M180
WINDOW 0 64 34 Left 2
WINDOW 3 61 68 Left 2
SYMATTR InstName Q193
SYMATTR Value BC857B
SYMBOL pnp 3216 14624 M180
WINDOW 0 64 34 Left 2
WINDOW 3 61 68 Left 2
SYMATTR InstName Q194
SYMATTR Value BC857B
SYMBOL npn 3344 14416 R0
SYMATTR InstName Q195
SYMATTR Value BC847B
SYMBOL pnp 3344 15040 M180
WINDOW 0 64 34 Left 2
WINDOW 3 61 68 Left 2
SYMATTR InstName Q196
SYMATTR Value BC857B
SYMBOL Res 3392 14304 R0
SYMATTR InstName R62
SYMATTR Value 10
SYMBOL Res 3392 15040 R0
SYMATTR InstName R63
SYMATTR Value 10
SYMBOL Res 3520 14736 R0
SYMATTR InstName R64
SYMATTR Value 470
SYMBOL Res 3520 14880 R0
SYMATTR InstName R65
SYMATTR Value 33
SYMBOL ind 3840 14752 R270
WINDOW 0 32 56 VTop 2
WINDOW 3 5 56 VBottom 2
SYMATTR InstName L1
SYMATTR Value 2mH
SYMATTR SpiceLine Rser=120 Cpar=1pF
SYMBOL Cap 3984 14752 R0
SYMATTR InstName C_ant1
SYMATTR Value 10pF
SYMBOL Res 3632 14752 R270
WINDOW 0 32 56 VTop 2
WINDOW 3 0 56 VBottom 2
SYMATTR InstName R66
SYMATTR Value 4.7
SYMBOL Res 3280 14720 R90
WINDOW 0 0 56 VBottom 2
WINDOW 3 32 56 VTop 2
SYMATTR InstName R67
SYMATTR Value 10
SYMBOL Cap 2832 14688 R0
SYMATTR InstName C16
SYMATTR Value 10n
SYMBOL npn -32 16464 M0
SYMATTR InstName Q120
SYMATTR Value BC847B
SYMBOL npn -256 16672 R0
SYMATTR InstName Q121
SYMATTR Value BC847B
SYMBOL npn -352 16464 R0
SYMATTR InstName Q122
SYMATTR Value BC847B
SYMBOL Res -208 16784 R0
SYMATTR InstName R54
SYMATTR Value 1
SYMBOL pnp -224 16112 R180
WINDOW 0 60 32 Left 2
WINDOW 3 58 66 Left 2
SYMATTR InstName Q123
SYMATTR Value BC857B
SYMBOL pnp -160 16112 M180
WINDOW 0 64 34 Left 2
WINDOW 3 61 68 Left 2
SYMATTR InstName Q124
SYMATTR Value BC857B
SYMBOL pnp -224 16272 R180
WINDOW 0 60 32 Left 2
WINDOW 3 58 66 Left 2
SYMATTR InstName Q126
SYMATTR Value BC857B
SYMBOL pnp -160 16272 M180
WINDOW 0 64 34 Left 2
WINDOW 3 61 68 Left 2
SYMATTR InstName Q127
SYMATTR Value BC857B
SYMBOL npn 384 16464 M0
SYMATTR InstName Q128
SYMATTR Value BC847B
SYMBOL npn 160 16672 R0
SYMATTR InstName Q129
SYMATTR Value BC847B
SYMBOL npn 64 16464 R0
SYMATTR InstName Q130
SYMATTR Value BC847B
SYMBOL Res 208 16784 R0
SYMATTR InstName R70
SYMATTR Value 1
SYMBOL pnp 192 16112 R180
WINDOW 0 60 32 Left 2
WINDOW 3 58 66 Left 2
SYMATTR InstName Q131
SYMATTR Value BC857B
SYMBOL pnp 256 16112 M180
WINDOW 0 64 34 Left 2
WINDOW 3 61 68 Left 2
SYMATTR InstName Q132
SYMATTR Value BC857B
SYMBOL pnp 192 16272 R180
WINDOW 0 60 32 Left 2
WINDOW 3 58 66 Left 2
SYMATTR InstName Q133
SYMATTR Value BC857B
SYMBOL pnp 256 16272 M180
WINDOW 0 64 34 Left 2
WINDOW 3 61 68 Left 2
SYMATTR InstName Q134
SYMATTR Value BC857B
SYMBOL Cap 512 16400 R0
SYMATTR InstName C8
SYMATTR Value 470p
SYMBOL Cap 0 16096 R0
SYMATTR InstName C10
SYMATTR Value 680p
SYMBOL npn -848 17712 M0
SYMATTR InstName Q137
SYMATTR Value BC847B
SYMBOL npn -1072 17920 R0
SYMATTR InstName Q138
SYMATTR Value BC847B
SYMBOL npn -1168 17712 R0
SYMATTR InstName Q139
SYMATTR Value BC847B
SYMBOL Res -576 17680 R0
SYMATTR InstName R74
SYMATTR Value 220
SYMBOL Res -1024 18032 R0
SYMATTR InstName R75
SYMATTR Value 100
SYMBOL pnp -1040 17424 R180
WINDOW 0 60 32 Left 2
WINDOW 3 58 66 Left 2
SYMATTR InstName Q140
SYMATTR Value BC857B
SYMBOL pnp -976 17424 M180
WINDOW 0 64 34 Left 2
WINDOW 3 61 68 Left 2
SYMATTR InstName Q141
SYMATTR Value BC857B
SYMBOL pnp -1040 17584 R180
WINDOW 0 60 32 Left 2
WINDOW 3 58 66 Left 2
SYMATTR InstName Q142
SYMATTR Value BC857B
SYMBOL pnp -976 17584 M180
WINDOW 0 64 34 Left 2
WINDOW 3 61 68 Left 2
SYMATTR InstName Q143
SYMATTR Value BC857B
SYMBOL npn -1312 17712 M0
SYMATTR InstName Q144
SYMATTR Value BC847B
SYMBOL npn -1536 17920 R0
SYMATTR InstName Q145
SYMATTR Value BC847B
SYMBOL npn -1632 17712 R0
SYMATTR InstName Q146
SYMATTR Value BC847B
SYMBOL Res -1488 18032 R0
SYMATTR InstName R77
SYMATTR Value 1
SYMBOL Res -576 17824 R0
SYMATTR InstName R78
SYMATTR Value 10
SYMBOL npn -32 17712 M0
SYMATTR InstName Q147
SYMATTR Value BC847B
SYMBOL npn -256 17920 R0
SYMATTR InstName Q148
SYMATTR Value BC847B
SYMBOL npn -352 17712 R0
SYMATTR InstName Q149
SYMATTR Value BC847B
SYMBOL Res -208 18032 R0
SYMATTR InstName R72
SYMATTR Value 1
SYMBOL pnp -224 17424 R180
WINDOW 0 60 32 Left 2
WINDOW 3 58 66 Left 2
SYMATTR InstName Q150
SYMATTR Value BC857B
SYMBOL pnp -160 17424 M180
WINDOW 0 64 34 Left 2
WINDOW 3 61 68 Left 2
SYMATTR InstName Q151
SYMATTR Value BC857B
SYMBOL pnp -224 17584 R180
WINDOW 0 60 32 Left 2
WINDOW 3 58 66 Left 2
SYMATTR InstName Q152
SYMATTR Value BC857B
SYMBOL pnp -160 17584 M180
WINDOW 0 64 34 Left 2
WINDOW 3 61 68 Left 2
SYMATTR InstName Q153
SYMATTR Value BC857B
SYMBOL npn 384 17712 M0
SYMATTR InstName Q154
SYMATTR Value BC847B
SYMBOL npn 160 17920 R0
SYMATTR InstName Q155
SYMATTR Value BC847B
SYMBOL npn 64 17712 R0
SYMATTR InstName Q156
SYMATTR Value BC847B
SYMBOL Res 208 18032 R0
SYMATTR InstName R73
SYMATTR Value 1
SYMBOL pnp 192 17424 R180
WINDOW 0 60 32 Left 2
WINDOW 3 58 66 Left 2
SYMATTR InstName Q157
SYMATTR Value BC857B
SYMBOL pnp 256 17424 M180
WINDOW 0 64 34 Left 2
WINDOW 3 61 68 Left 2
SYMATTR InstName Q158
SYMATTR Value BC857B
SYMBOL pnp 192 17584 R180
WINDOW 0 60 32 Left 2
WINDOW 3 58 66 Left 2
SYMATTR InstName Q159
SYMATTR Value BC857B
SYMBOL pnp 256 17584 M180
WINDOW 0 64 34 Left 2
WINDOW 3 61 68 Left 2
SYMATTR InstName Q160
SYMATTR Value BC857B
SYMBOL Cap 496 17696 R0
SYMATTR InstName C11
SYMATTR Value 470p
SYMBOL Cap 0 17408 R0
SYMATTR InstName C12
SYMATTR Value 680p
SYMBOL npn 2752 16704 M0
SYMATTR InstName Q1
SYMATTR Value BC847B
SYMBOL npn 2528 16912 R0
SYMATTR InstName Q2
SYMATTR Value BC847B
SYMBOL npn 2432 16704 R0
SYMATTR InstName Q3
SYMATTR Value BC847B
SYMBOL Res 2576 17024 R0
SYMATTR InstName R2
SYMATTR Value 1
SYMBOL pnp 2944 16064 R180
WINDOW 0 60 32 Left 2
WINDOW 3 58 66 Left 2
SYMATTR InstName Q4
SYMATTR Value BC857B
SYMBOL pnp 3008 16064 M180
WINDOW 0 64 34 Left 2
WINDOW 3 61 68 Left 2
SYMATTR InstName Q5
SYMATTR Value BC857B
SYMBOL pnp 2944 16224 R180
WINDOW 0 60 32 Left 2
WINDOW 3 58 66 Left 2
SYMATTR InstName Q6
SYMATTR Value BC857B
SYMBOL pnp 3008 16224 M180
WINDOW 0 64 34 Left 2
WINDOW 3 61 68 Left 2
SYMATTR InstName Q7
SYMATTR Value BC857B
SYMBOL pnp 2752 16448 R180
WINDOW 0 60 32 Left 2
WINDOW 3 58 66 Left 2
SYMATTR InstName Q8
SYMATTR Value BC857B
SYMBOL pnp 2816 16448 M180
WINDOW 0 64 34 Left 2
WINDOW 3 61 68 Left 2
SYMATTR InstName Q9
SYMATTR Value BC857B
SYMBOL pnp 2752 16608 R180
WINDOW 0 60 32 Left 2
WINDOW 3 58 66 Left 2
SYMATTR InstName Q10
SYMATTR Value BC857B
SYMBOL pnp 2816 16608 M180
WINDOW 0 64 34 Left 2
WINDOW 3 61 68 Left 2
SYMATTR InstName Q11
SYMATTR Value BC857B
SYMBOL npn 3008 16832 R0
SYMATTR InstName Q12
SYMATTR Value BC847B
SYMBOL npn 2944 16832 M0
SYMATTR InstName Q13
SYMATTR Value BC847B
SYMBOL npn 3008 16992 R0
SYMATTR InstName Q14
SYMATTR Value BC847B
SYMBOL npn 2944 16992 M0
SYMATTR InstName Q15
SYMATTR Value BC847B
SYMBOL Cap 3136 16496 R0
SYMATTR InstName C2
SYMATTR Value 20p
SYMBOL e 3312 16400 R0
SYMATTR InstName E3
SYMATTR Value 10000
SYMBOL npn 2176 16704 M0
SYMATTR InstName Q16
SYMATTR Value BC847B
SYMBOL npn 1952 16912 R0
SYMATTR InstName Q17
SYMATTR Value BC847B
SYMBOL npn 1856 16704 R0
SYMATTR InstName Q18
SYMATTR Value BC847B
SYMBOL Res 2000 17024 R0
SYMATTR InstName R3
SYMATTR Value 1
SYMBOL Res 3408 16448 R0
SYMATTR InstName R4
SYMATTR Value 2k
SYMBOL Res 3408 16736 R0
SYMATTR InstName R5
SYMATTR Value 20
SYMBOL npn 2336 16912 R0
SYMATTR InstName Q19
SYMATTR Value BC847B
SYMBOL Res 2384 17024 R0
SYMATTR InstName R6
SYMATTR Value 1
SYMBOL npn 2144 16912 R0
SYMATTR InstName Q20
SYMATTR Value BC847B
SYMBOL Res 2192 17024 R0
SYMATTR InstName R7
SYMATTR Value 1
SYMBOL npn 2720 16912 R0
SYMATTR InstName Q21
SYMATTR Value BC847B
SYMBOL Res 2768 17024 R0
SYMATTR InstName R8
SYMATTR Value 100
SYMBOL npn -944 16464 M0
SYMATTR InstName Q22
SYMATTR Value BC847B
SYMBOL npn -1168 16672 R0
SYMATTR InstName Q23
SYMATTR Value BC847B
SYMBOL npn -1264 16464 R0
SYMATTR InstName Q24
SYMATTR Value BC847B
SYMBOL Res -672 16432 R0
SYMATTR InstName R9
SYMATTR Value 220
SYMBOL Res -1120 16784 R0
SYMATTR InstName R10
SYMATTR Value 100
SYMBOL Res -1312 16528 R0
SYMATTR InstName R11
SYMATTR Value 100
SYMBOL pnp -1136 16112 R180
WINDOW 0 60 32 Left 2
WINDOW 3 58 66 Left 2
SYMATTR InstName Q25
SYMATTR Value BC857B
SYMBOL pnp -1072 16112 M180
WINDOW 0 64 34 Left 2
WINDOW 3 61 68 Left 2
SYMATTR InstName Q26
SYMATTR Value BC857B
SYMBOL pnp -1136 16272 R180
WINDOW 0 60 32 Left 2
WINDOW 3 58 66 Left 2
SYMATTR InstName Q27
SYMATTR Value BC857B
SYMBOL pnp -1072 16272 M180
WINDOW 0 64 34 Left 2
WINDOW 3 61 68 Left 2
SYMATTR InstName Q28
SYMATTR Value BC857B
SYMBOL npn -1408 16464 M0
SYMATTR InstName Q29
SYMATTR Value BC847B
SYMBOL npn -1632 16672 R0
SYMATTR InstName Q30
SYMATTR Value BC847B
SYMBOL npn -1728 16464 R0
SYMATTR InstName Q31
SYMATTR Value BC847B
SYMBOL Res -1584 16784 R0
SYMATTR InstName R12
SYMATTR Value 1
SYMBOL Res -672 16656 R0
SYMATTR InstName R13
SYMATTR Value 12
SYMBOL Res -912 16528 R0
SYMATTR InstName R14
SYMATTR Value 100
SYMBOL Res -1232 17808 R0
SYMATTR InstName R18
SYMATTR Value 100
SYMBOL Res -1792 16528 R0
SYMATTR InstName R19
SYMATTR Value 100
SYMBOL Res -1696 17776 R0
SYMATTR InstName R20
SYMATTR Value 100
SYMBOL Res -816 17792 R0
SYMATTR InstName R22
SYMATTR Value 100
SYMBOL npn 1008 16464 M0
SYMATTR InstName Q32
SYMATTR Value BC847B
SYMBOL npn 784 16672 R0
SYMATTR InstName Q33
SYMATTR Value BC847B
SYMBOL npn 688 16464 R0
SYMATTR InstName Q34
SYMATTR Value BC847B
SYMBOL Res 832 16784 R0
SYMATTR InstName R23
SYMATTR Value 1
SYMBOL pnp 816 16112 R180
WINDOW 0 60 32 Left 2
WINDOW 3 58 66 Left 2
SYMATTR InstName Q35
SYMATTR Value BC857B
SYMBOL pnp 880 16112 M180
WINDOW 0 64 34 Left 2
WINDOW 3 61 68 Left 2
SYMATTR InstName Q36
SYMATTR Value BC857B
SYMBOL pnp 816 16272 R180
WINDOW 0 60 32 Left 2
WINDOW 3 58 66 Left 2
SYMATTR InstName Q37
SYMATTR Value BC857B
SYMBOL pnp 880 16272 M180
WINDOW 0 64 34 Left 2
WINDOW 3 61 68 Left 2
SYMATTR InstName Q38
SYMATTR Value BC857B
SYMBOL npn 1152 16672 R0
SYMATTR InstName Q39
SYMATTR Value BC847B
SYMBOL Res 1200 16784 R0
SYMATTR InstName R24
SYMATTR Value 1
SYMBOL npn 1152 16320 R0
SYMATTR InstName Q40
SYMATTR Value BC847B
SYMBOL npn 1376 16672 R0
SYMATTR InstName Q41
SYMATTR Value BC847B
SYMBOL Res 1424 16784 R0
SYMATTR InstName R25
SYMATTR Value 1
SYMBOL npn 1024 17712 M0
SYMATTR InstName Q42
SYMATTR Value BC847B
SYMBOL npn 800 17920 R0
SYMATTR InstName Q43
SYMATTR Value BC847B
SYMBOL npn 704 17712 R0
SYMATTR InstName Q44
SYMATTR Value BC847B
SYMBOL Res 848 18032 R0
SYMATTR InstName R26
SYMATTR Value 1
SYMBOL pnp 832 17440 R180
WINDOW 0 60 32 Left 2
WINDOW 3 58 66 Left 2
SYMATTR InstName Q45
SYMATTR Value BC857B
SYMBOL pnp 896 17440 M180
WINDOW 0 64 34 Left 2
WINDOW 3 61 68 Left 2
SYMATTR InstName Q46
SYMATTR Value BC857B
SYMBOL pnp 832 17600 R180
WINDOW 0 60 32 Left 2
WINDOW 3 58 66 Left 2
SYMATTR InstName Q47
SYMATTR Value BC857B
SYMBOL pnp 896 17600 M180
WINDOW 0 64 34 Left 2
WINDOW 3 61 68 Left 2
SYMATTR InstName Q48
SYMATTR Value BC857B
SYMBOL npn 1168 17920 R0
SYMATTR InstName Q49
SYMATTR Value BC847B
SYMBOL Res 1216 18032 R0
SYMATTR InstName R27
SYMATTR Value 1
SYMBOL npn 1168 17616 R0
SYMATTR InstName Q50
SYMATTR Value BC847B
SYMBOL npn 1392 17920 R0
SYMATTR InstName Q51
SYMATTR Value BC847B
SYMBOL Res 1440 18032 R0
SYMATTR InstName R28
SYMATTR Value 1
SYMBOL OpAmps/AD8031 -1040 18512 R0
SYMATTR InstName U1
TEXT -440 13760 Left 2 !.tran 0 12m 0n 0.5n
TEXT 408 13712 Left 4 ;Wide frequency range VCO for Theremin AFE
TEXT 2832 14048 Left 2 !.ic V(RC1)=2.251\n.ic V(RC2)=2.252\n.ic V(INT1)=2.82
TEXT 2800 13984 Left 4 ;Amplitude limiter
TEXT 2504 14256 Left 3 ;Unity gain output buffer - operational amplifier with current feedback
TEXT -760 16056 Left 2 !.ic V(PP1)=2.25\n.ic V(PP2)=2.255\n.ic V(PP3)=2.25\n.ic V(PP4)=2.253
TEXT -1528 17328 Left 4 ;Inverting amplifier\namplitude limiter
TEXT -1624 16032 Left 4 ;Inverting amplifier\namplitude limiter

The netlist it stands for:
* vco_sine_bjt_v03.asc
V1 COM 0 4.5
V2 VREF 0 2.25
V19 VCC33 0 3.3
V4 VREF12 0 1.2
Q52 N001 VCOBIAS1 N003 0 BC847B
R60 COM VCOBIAS2 22k
R1 COM VCOBIAS3 4.7k
I1 COM N001 PWL(0 30u 400u 30u 10m 300u)
Q54 VCOBIAS2 VCOBIAS2 N013 0 BC847B
Q55 VCOBIAS3 VCOBIAS3 N019 0 BC847B
Q53 COM N001 VCOBIAS1 0 BC847B
R15 N003 0 1
R16 N019 0 100
R17 N013 0 100
C1 NC_01 0 1n
R40 COM VCOBIAS22 22k
Q125 VCOBIAS22 VCOBIAS22 N012 0 BC847B
R41 N012 0 100
Q179 N008 BIAS_P N005 0 BC857B
Q180 BIAS_P BIAS_P N004 0 BC857B
Q181 0 VCOOUT N008 0 BC857B
Q182 COM VCOOUT N011 0 BC847B
Q183 N014 N011 N010 0 BC857B
Q184 N002 N008 N010 0 BC847B
R56 COM N004 300
R57 COM N005 100
R58 N016 0 300
R59 N017 0 100
Q185 BIAS_N BIAS_N N016 0 BC847B
Q186 N011 BIAS_N N017 0 BC847B
R61 BIAS_P BIAS_N 20k
Q187 N009 N002 COM 0 BC857B
Q188 N002 N002 COM 0 BC857B
Q189 N014 N014 0 0 BC847B
Q190 N009 N014 0 0 BC847B
C15 N009 0 10p
Q191 N015 N014 0 0 BC847B
Q192 COM N009 N015 0 BC847B
Q193 N007 N002 COM 0 BC857B
Q194 0 N009 N007 0 BC857B
Q195 N006 N007 SENSE 0 BC847B
Q196 N018 N015 SENSE 0 BC857B
R62 COM N006 10
R63 N018 0 10
R64 SENSE SNSDIV 470
R65 SNSDIV VREF 33
L1 DRIVE ANT 2mH Rser=120 Cpar=1pF
C_ant1 ANT 0 10pF
R66 SENSE DRIVE 4.7
R67 SENSE N010 10
C16 N008 N011 10n
Q120 PP1 PP1 N044 0 BC847B
Q121 N044 VCOBIAS1 N050 0 BC847B
Q122 N032 LIM1 N044 0 BC847B
R54 N050 0 1
Q123 N027 N022 COM 0 BC857B
Q124 N022 N022 COM 0 BC857B
Q126 N032 N032 N027 0 BC857B
Q127 PP1 N032 N022 0 BC857B
Q128 PP2 LPOUT1 N045 0 BC847B
Q129 N045 VCOBIAS1 N051 0 BC847B
Q130 N033 PP1 N045 0 BC847B
R70 N051 0 1
Q131 N028 N023 COM 0 BC857B
Q132 N023 N023 COM 0 BC857B
Q133 N033 N033 N028 0 BC857B
Q134 PP2 N033 N023 0 BC857B
C8 PP2 0 470p
C10 LPOUT1 PP1 680p
Q137 LIM2 N081 N083 0 BC847B
Q138 N083 VCOBIAS2 N088 0 BC847B
Q139 N073 N080 N083 0 BC847B
R74 LIM2 N078 220
R75 N088 0 100
Q140 N069 N065 COM 0 BC857B
Q141 N065 N065 COM 0 BC857B
Q142 N073 N073 N069 0 BC857B
Q143 LIM2 N073 N065 0 BC857B
Q144 LIM2 N078 N082 0 BC847B
Q145 N082 VCOBIAS1 N087 0 BC847B
Q146 N073 N079 N082 0 BC847B
R77 N087 0 1
R78 N078 VREF 10
Q147 PP3 PP3 N084 0 BC847B
Q148 N084 VCOBIAS1 N089 0 BC847B
Q149 N074 LIM2 N084 0 BC847B
R72 N089 0 1
Q150 N070 N066 COM 0 BC857B
Q151 N066 N066 COM 0 BC857B
Q152 N074 N074 N070 0 BC857B
Q153 PP3 N074 N066 0 BC857B
Q154 PP4 LPOUT2 N085 0 BC847B
Q155 N085 VCOBIAS1 N090 0 BC847B
Q156 N075 PP3 N085 0 BC847B
R73 N090 0 1
Q157 N071 N067 COM 0 BC857B
Q158 N067 N067 COM 0 BC857B
Q159 N075 N075 N071 0 BC857B
Q160 PP4 N075 N067 0 BC857B
C11 PP4 0 470p
C12 LPOUT2 PP3 680p
Q1 N041 VREF N057 0 BC847B
Q2 N057 VCOBIAS1 N063 0 BC847B
Q3 N030 LPOUT2 N057 0 BC847B
R2 N063 0 1
Q4 N025 N020 COM 0 BC857B
Q5 N020 N020 COM 0 BC857B
Q6 N030 N030 N025 0 BC857B
Q7 AMP1 N030 N020 0 BC857B
Q8 N040 N036 COM 0 BC857B
Q9 N036 N036 COM 0 BC857B
Q10 N041 N041 N040 0 BC857B
Q11 N055 N041 N036 0 BC857B
Q12 AMP1 N055 N058 0 BC847B
Q13 N055 N055 N059 0 BC847B
Q14 N058 N058 0 0 BC847B
Q15 N059 N058 0 0 BC847B
C2 AMP1 0 20p
E3 VCOOUT 0 AMP1 VCOOUT 10000
Q16 N041 N047 N056 0 BC847B
Q17 N056 VCOBIAS1 N060 0 BC847B
Q18 N030 VREF N056 0 BC847B
R3 N060 0 1
R4 VCOOUT N047 2k
R5 N047 VREF 20
Q19 N057 VCOBIAS1 N062 0 BC847B
R6 N062 0 1
Q20 N057 VCOBIAS1 N061 0 BC847B
R7 N061 0 1
Q21 N057 VCOBIAS1 N064 0 BC847B
R8 N064 0 100
Q22 LIM1 N039 N043 0 BC847B
Q23 N043 VCOBIAS2 N049 0 BC847B
Q24 N031 N037 N043 0 BC847B
R9 LIM1 N037 220
R10 N049 0 100
R11 NC_02 VREF 100
Q25 N026 N021 COM 0 BC857B
Q26 N021 N021 COM 0 BC857B
Q27 N031 N031 N026 0 BC857B
Q28 LIM1 N031 N021 0 BC857B
Q29 LIM1 N037 N042 0 BC847B
Q30 N042 VCOBIAS1 N048 0 BC847B
Q31 N031 N038 N042 0 BC847B
R12 N048 0 1
R13 N037 VREF 12
R14 N039 LPOUT2 100
R18 N080 LPOUT1 100
R19 N038 VREF 100
R20 N079 VREF 100
R22 N081 VREF 100
Q32 N035 LPOUT1 N046 0 BC847B
Q33 N046 VCOBIAS1 N052 0 BC847B
Q34 N034 PP2 N046 0 BC847B
R23 N052 0 1
Q35 N029 N024 COM 0 BC857B
Q36 N024 N024 COM 0 BC857B
Q37 N034 N034 N029 0 BC857B
Q38 N035 N034 N024 0 BC857B
Q39 LPOUT1 VCOBIAS1 N053 0 BC847B
R24 N053 0 1
Q40 COM N035 LPOUT1 0 BC847B
Q41 LPOUT1 VCOBIAS1 N054 0 BC847B
R25 N054 0 1
Q42 N077 LPOUT2 N086 0 BC847B
Q43 N086 VCOBIAS1 N091 0 BC847B
Q44 N076 PP4 N086 0 BC847B
R26 N091 0 1
Q45 N072 N068 COM 0 BC857B
Q46 N068 N068 COM 0 BC857B
Q47 N076 N076 N072 0 BC857B
Q48 N077 N076 N068 0 BC857B
Q49 LPOUT2 VCOBIAS1 N092 0 BC847B
R27 N092 0 1
Q50 COM N077 LPOUT2 0 BC847B
Q51 LPOUT2 VCOBIAS1 N093 0 BC847B
R28 N093 0 1
XU1 NC_03 NC_04 NC_05 NC_06 NC_07 AD8031  ; pins In+ In- V+ V- OUT
.model NPN NPN
.model PNP PNP
.lib standard.bjt
.tran 0 12m 0n 0.5n
* Wide frequency range VCO for Theremin AFE
.ic V(RC1)=2.251
.ic V(RC2)=2.252
.ic V(INT1)=2.82
* Amplitude limiter
* Unity gain output buffer - operational amplifier with current feedback
.ic V(PP1)=2.25
.ic V(PP2)=2.255
.ic V(PP3)=2.25
.ic V(PP4)=2.253
* Inverting amplifier
* amplitude limiter
* Inverting amplifier
* amplitude limiter
.backanno
.end